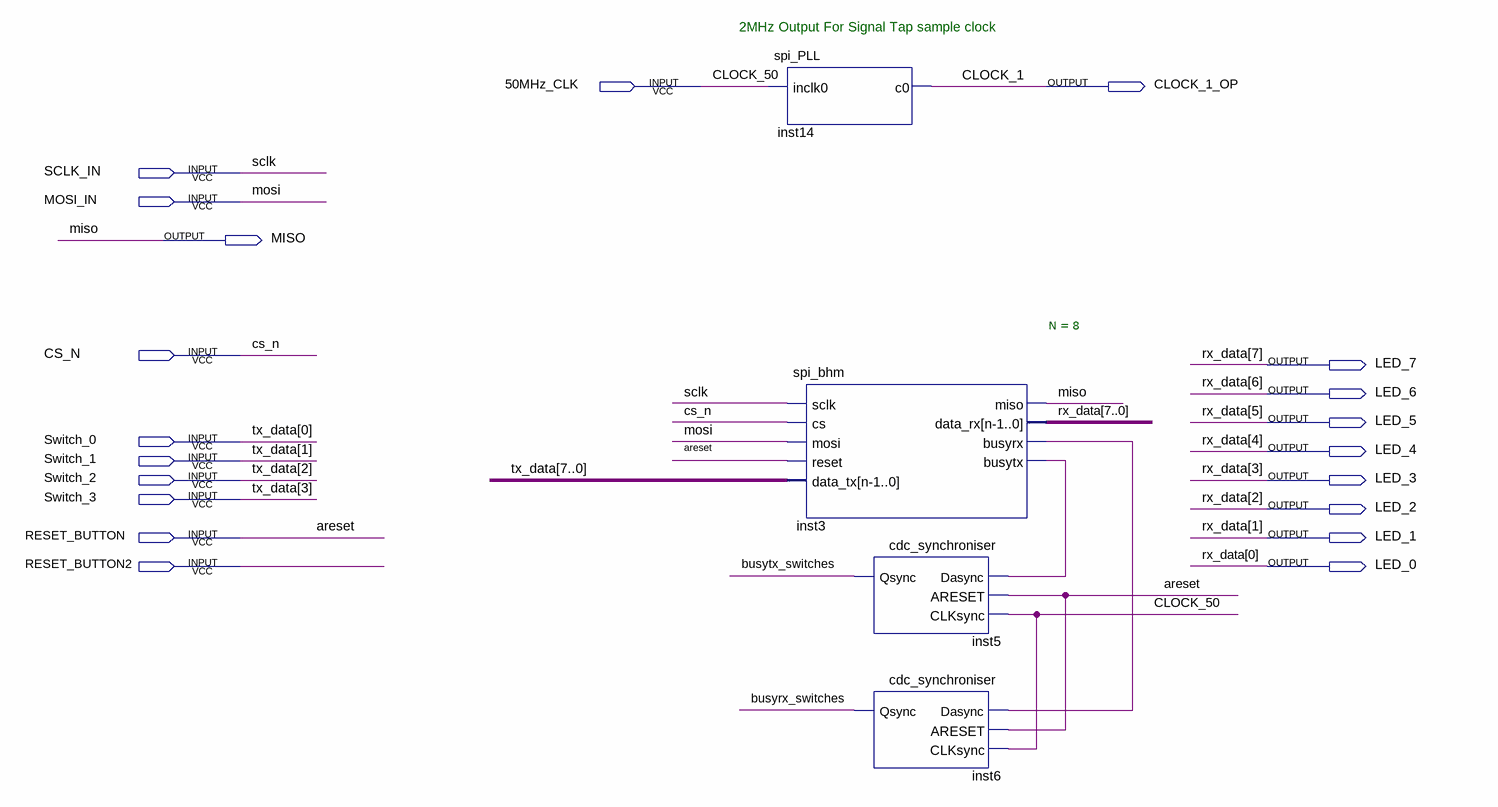
[diagram p0: schematic sheet]
// Quartus schematic spi_test.bdf as structural Verilog: 4 symbols, 20 pins
module spi_test (
  input  \50MHz_CLK ,
  input  SCLK_IN,
  input  MOSI_IN,
  input  CS_N,
  input  Switch_0,
  input  Switch_1,
  input  Switch_2,
  input  Switch_3,
  input  RESET_BUTTON,
  input  RESET_BUTTON2,
  output CLOCK_1_OP,
  output MISO,
  output LED_7,
  output LED_6,
  output LED_5,
  output LED_4,
  output LED_3,
  output LED_2,
  output LED_1,
  output LED_0
);

  wire busyrx_switches, busytx_switches, inst3_busyrx, inst3_busytx;
  wire [7:4] tx_data;

  spi_PLL inst14 (.inclk0(\50MHz_CLK ), .c0(CLOCK_1_OP));
  spi_bhm #(.N(8)) inst3 (
    .sclk(SCLK_IN), .cs(CS_N), .mosi(MOSI_IN), .reset(RESET_BUTTON),
    .data_tx({tx_data, Switch_3, Switch_2, Switch_1, Switch_0}), .miso(MISO),
    .data_rx({LED_7, LED_6, LED_5, LED_4, LED_3, LED_2, LED_1, LED_0}), .busyrx(inst3_busyrx),
    .busytx(inst3_busytx));
  cdc_synchroniser inst5 (.Dasync(inst3_busytx), .ARESET(RESET_BUTTON), .CLKsync(\50MHz_CLK ), .Qsync(busytx_switches));
  cdc_synchroniser inst6 (.Dasync(inst3_busyrx), .ARESET(RESET_BUTTON), .CLKsync(\50MHz_CLK ), .Qsync(busyrx_switches));

  // Other names for the same wires on the sheet: areset = RESET_BUTTON; CLOCK_1 = CLOCK_1_OP; CLOCK_50 = \50MHz_CLK ;
  //   mosi = MOSI_IN; rx_data[7:0] = {LED_7, LED_6, LED_5, LED_4, LED_3, LED_2, LED_1, LED_0}; sclk = SCLK_IN;
  //   tx_data[3:0] = {Switch_3, Switch_2, Switch_1, Switch_0}

  // Notes on the sheet:
  //   2MHz Output For Signal Tap sample clock
endmodule
